# Altium schematic sheet power.SchDoc
size 209 x 297 mm; Scale: 1:1; Обозначение документа: АБВГ.123456.001 Э3; Номер листа: 2; Разраб.: Наумов; Пров.: Некрасов; Утв.: Некрасов; Масштаб: 1:1; Литера: У; Наименование организации: НИЯУ МИФИ; Перв. применение: АБВГ.123456.000; Наименование изделия 1: Плата силовая; Наименование изделия 2: Схема электрическая; Наименование изделия 3: принципиальная; Нач. отд.: Нач. отд.
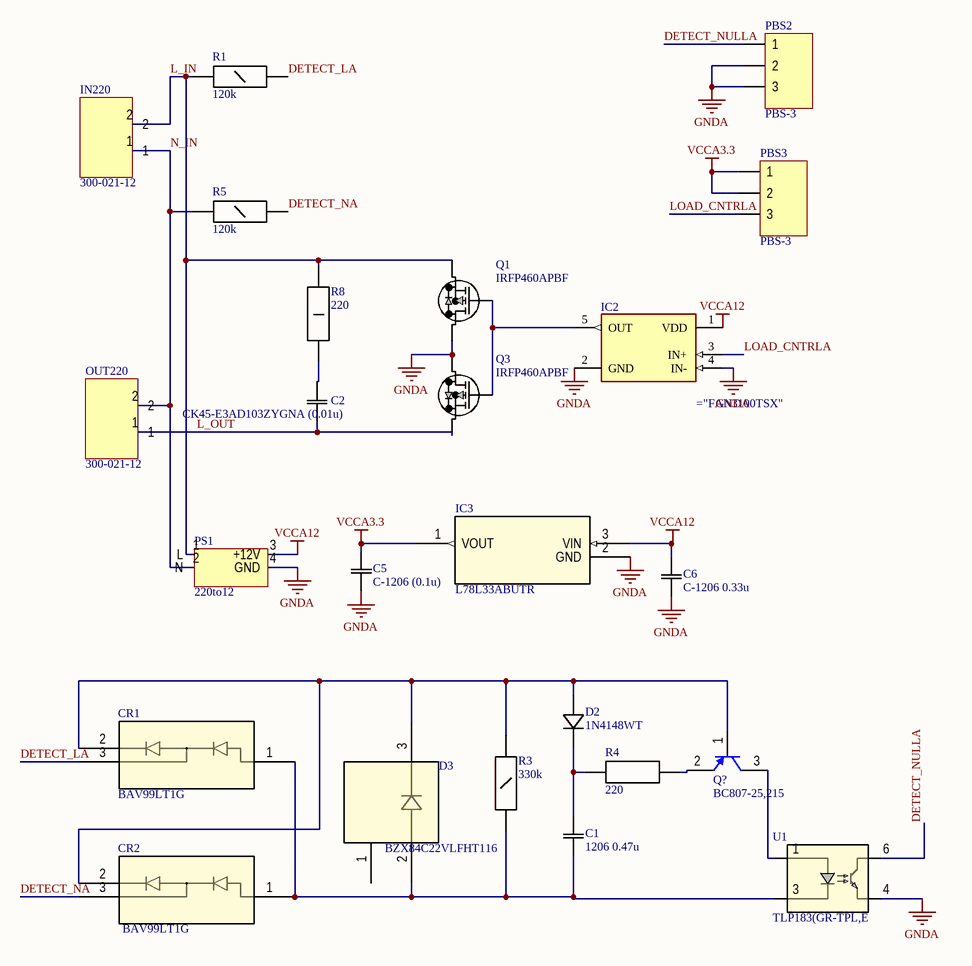
[diagram p0: power.SchDoc]

## Parts
C1  1206 0.47u  [CAP_X7R_1206_AVX]
C2  CK45-E3AD103ZYGNA (0.01u)  [CAP_CK45E3103_TDK]
C5  C-1206 (0.1u)  [CAP_X7R_1206_AVX]
C6  C-1206 0.33u  [CAP_X7R_1206_AVX]
CR1  BAV99LT1G  [SOT-23_TO-236_318-08_ONS]
CR2  BAV99LT1G  [SOT-23_TO-236_318-08_ONS]
D2  1N4148WT  [CR_SOD-523F_ONS]
D3  BZX84C22VLFHT116  [TRANS_BZX84_ROM]
IC2  FAN3100TSX  [ON_Semi_527AH_0]  (value not drawn)
IC3  L78L33ABUTR  [SOT-89_STM]
IN220  300-021-12  [300-021-12]
OUT220  300-021-12  [300-021-12]
PBS2  PBS-3  [PBS-3]
PBS3  PBS-3  [PBS-3]
PS1  220to12  [220to12]
Q1  IRFP460APBF  [TO-247AC_VIS]
Q3  IRFP460APBF  [TO-247AC_VIS]
Q?  BC807-25,215  [SOT23_BC807_NEX]
R1  120k  [CAP_X7R_1206_AVX]
R3  330k  [CAP_X7R_1206_AVX]
R4  220  [G-21_MUR]
R5  120k  [CAP_X7R_1206_AVX]
R8  220  [RES2512_TL_TYCO_TYC]
U1  TLP183(GR-TPL,E  [4pin SO6_TOS]

## Nets
GNDA: C5.1 C6.1 IC2.2(GND) IC2.4(IN-) IC3.2(GND) PBS2.2 PBS2.3 PS1.4(GND) Q1.2(D) Q3.2(D) U1.4
VCCA3.3: C5.2 IC3.1(VOUT) PBS3.1 PBS3.2
VCCA12: C6.2 IC2.1(VDD) IC3.3(VIN) PS1.3(+12V)
DETECT_LA: CR1.3 R1.2
DETECT_NA: CR2.3 R5.2
DETECT_NULLA: PBS2.1 U1.6
L_IN: IN220.2 PS1.1(L) Q1.3(S) R1.1 R8.2
L_OUT: C2.1 OUT220.1 Q3.3(S)
LOAD_CNTRLA: IC2.3(IN+) PBS3.3
N_IN: IN220.1 OUT220.2 PS1.2(N) R5.1
NetC1_1: C1.1 CR1.1 CR2.1 D3.2 R3.1 U1.3
NetC1_2: C1.2 D2.1 R4.1
NetC2_2: C2.2 R8.1
NetCR1_2: CR1.2 CR2.2 D2.2 D3.3 Q?.1(B) R3.2
NetIC2_5: IC2.5(OUT) Q1.1(G) Q3.1(G)
NetQ?_2: Q?.2 R4.2
NetQ?_3: Q?.3(C) U1.1

Not connected (* = marked no-connect by the designer): D3 1(2)

## Notes on the sheet
- Перв. примен.
- Справ. №
- Подп. и дата
- Инв. № дубл.
- Взам. инв. №
- Разраб.
- Изм.
- Лист
- № докум.
- Подп.
- Дата
- Лит.
- Масса
- Масштаб
- Пров.
- Т.контр.
- Листов
- Инв. № подл.
- Утв.
- Н.контр.
- Копировал
- Формат А4

## Library data of the parts
C1 C5 C6 = C-1206: No Description Available; Manufacturer_Part_Number: 12061C104KAT2A; Vendor: AVX Corporation; Built_By: EMA_UL_Team; SourceLibrary: AVX_2012-08-08; Type: DEV; Copyright: Copyright (C) 2018 Accelerated Designs. All rights reserved; RefDes: RefDes
C2 = CK45-E3AD103ZYGNA: No Description Available; Built_By: EMA_Matt; Vendor: TDK; SourceLibrary: TDK_2019-10-09; Type: DEV; Copyright: Copyright (C) 2018 Accelerated Designs. All rights reserved; Manufacturer_Part_Number: CK45-E3AD103ZYGNA; RefDes: RefDes
CR1 CR2 = BAV99LT1G: No Description Available; Vendor: ON Semiconductor; Built_By: EMA_Cory; SourceLibrary: ON_Semiconductor_2020-05-27; Type: DEV; Datasheet: https://www.onsemi.com/pub/Collateral/BAV99LT1-D.PDF; Manufacturer_Part_Number: BAV99LT1G; Copyright: Copyright (C) 2018 Accelerated Designs. All rights reserved; RefDes: RefDes
D2 = 1N4148WT: No Description Available; Vendor: ON Semiconductor; Built_By: EMA_Cory; SourceLibrary: ON_Semiconductor_2020-03-23; Type: DEV; Datasheet: https://www.onsemi.com/pub/Collateral/1N914BWT-D.pdf; Manufacturer_Part_Number: 1N4148WT; Copyright: Copyright (C) 2018 Accelerated Designs. All rights reserved; RefDes: RefDes
D3 = BZX84C22VLFHT116: No Description Available; Vendor: ROHM Semiconductor; Built_By: EMA_Matt; SourceLibrary: Rohm_2019-09-23; Type: DEV; Manufacturer_Part_Number: BZX84C22VLFHT116; Copyright: Copyright (C) 2018 Accelerated Designs. All rights reserved; RefDes: RefDes
IC3 = L78L33ABUTR: No Description Available; SourceLibrary: StMicro_2011-06-07; Built_By: EMA_UL_Team; Vendor: STMicroelectronics; Manufacturer_Part_Number: L78L33ABUTR; Copyright: Copyright (C) 2018 Accelerated Designs. All rights reserved; RefDes: RefDes; Type: DEV
Q1 Q3 = IRFP460APBF: No Description Available; Vendor: Vishay; Built_By: EMA_UL_Team; SourceLibrary: Vishay_2020-02-10; Type: DEV; Manufacturer_Part_Number: IRFP460APBF; Copyright: Copyright (C) 2018 Accelerated Designs. All rights reserved; RefDes: RefDes
Q? = BC807-25,215: No Description Available; Built_By: EMA_Justin; Vendor: Nexperia; SourceLibrary: Nexperia_2018-12-15; Type: DEV; Copyright: Copyright (C) 2016 Accelerated Designs. All rights reserved; Manufacturer_Part_Number: BC807-25,215; RefDes: RefDes
R1 R3 R5 = R-1206
R4 = res0805: Resistor 0805
R8 = R-2512: No Description Available; Manufacturer_Part_Number: TL3AR033F; Vendor: TE Connectivity; Built_By: EMA_UL_Team; SourceLibrary: Tyco_2012-01-31a; Copyright: Copyright (C) 2018 Accelerated Designs. All rights reserved; RefDes: RefDes; Type: DEV
U1 = TLP183(GR-TPL,E: No Description Available; Vendor: Toshiba; Built_By: EMA_UL_Team; SourceLibrary: Toshiba_2019-12-10; Number_devices_in_Package: 1; Manufacturer_Part_Number: TLP183(GR-TPL,E; Copyright: Copyright (C) 2018 Accelerated Designs. All rights reserved; RefDes: RefDes; Type: DEV; Source_Package: TLP183